# EAGLE design av3-batter-board (EAGLE 5.10)
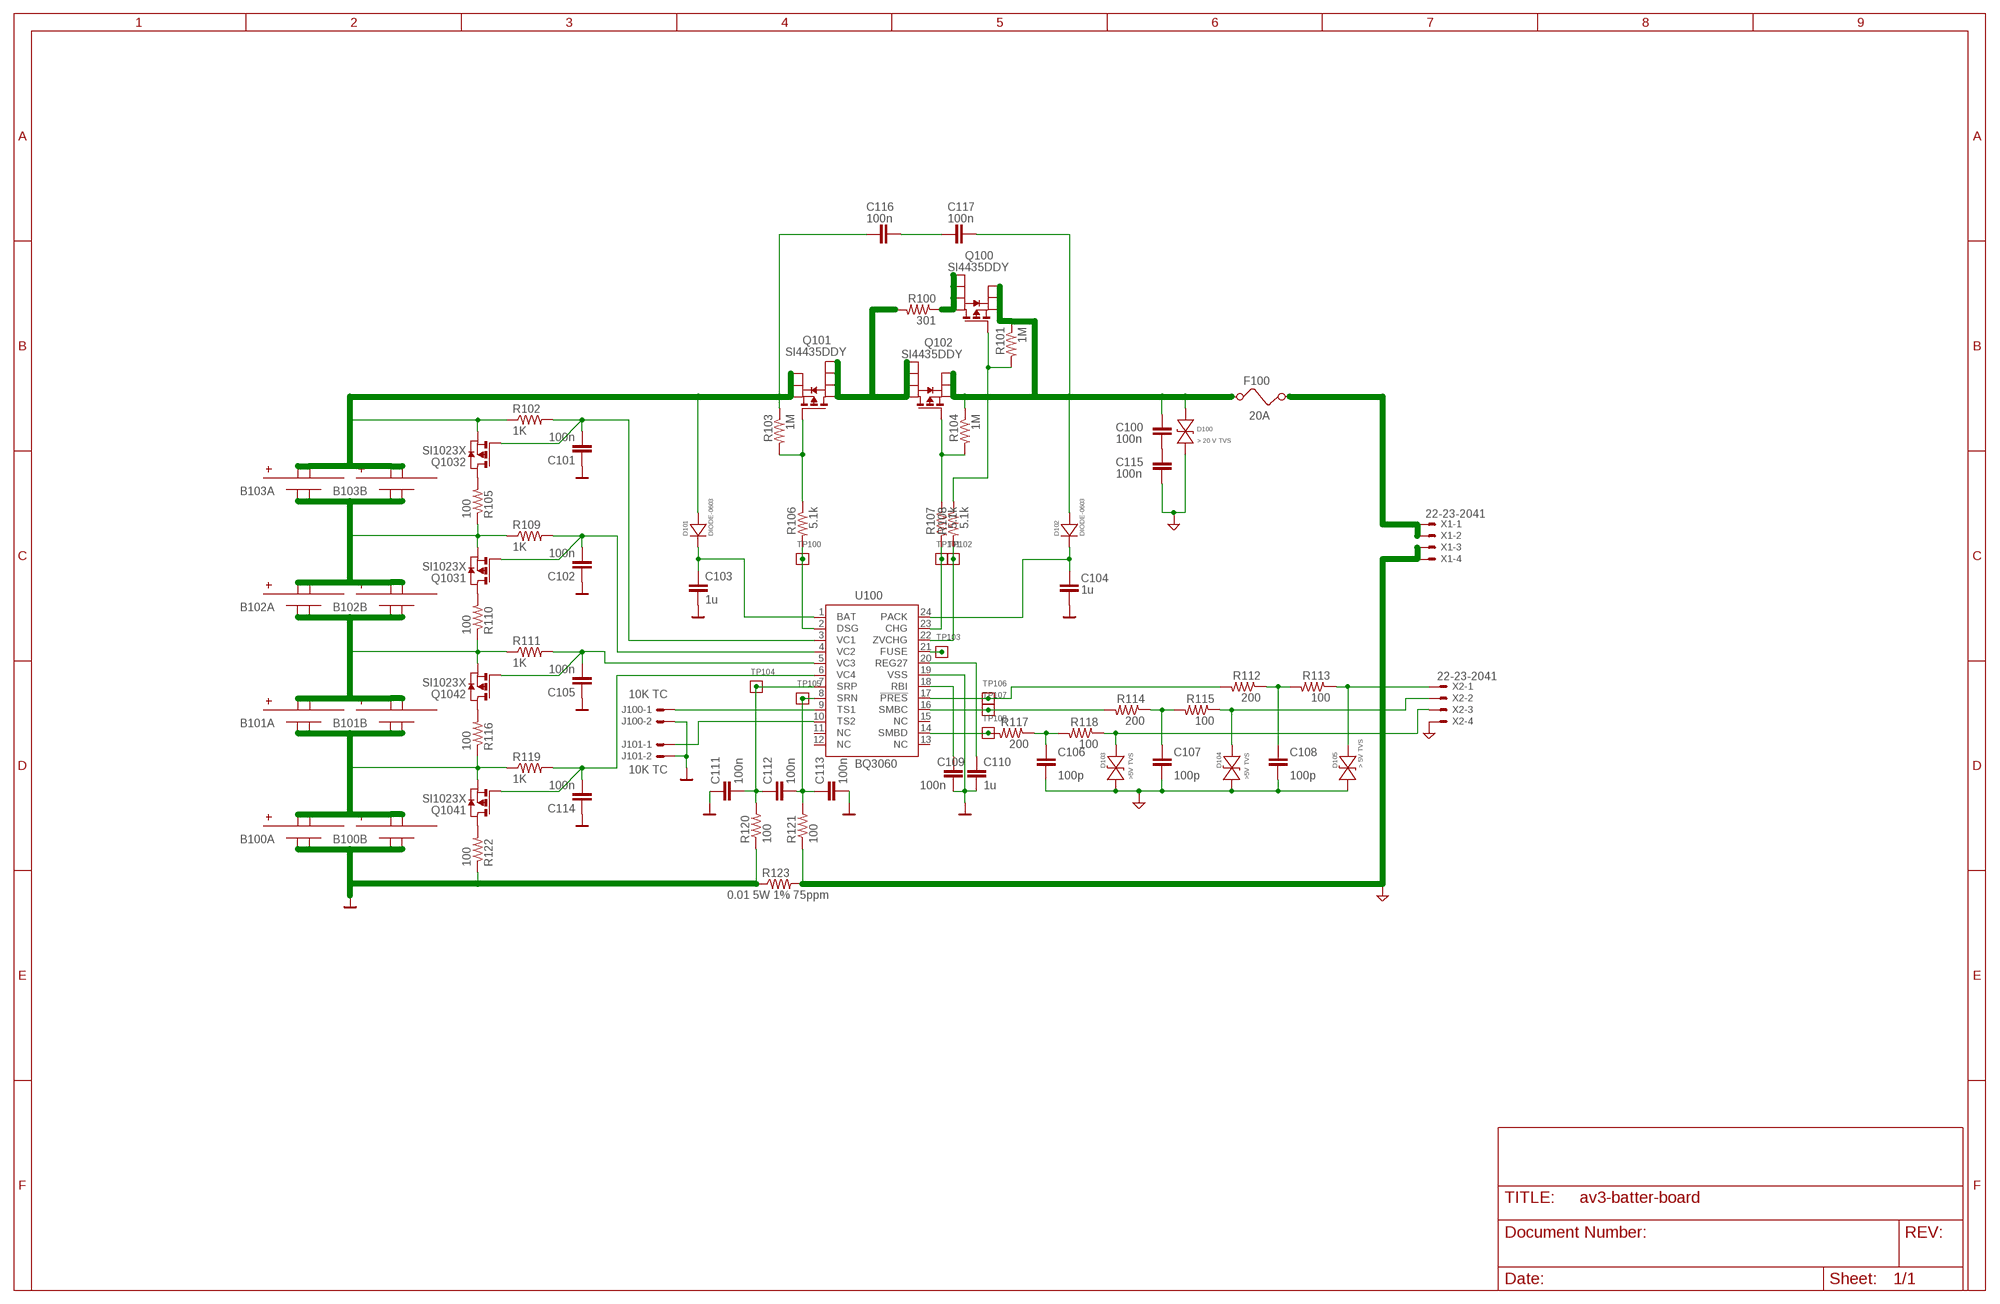
[diagram p0: schematic, sheet 1]

## Parts
B100A  LIPO-8AHR  [LIPO-8AHR-PAC]
B100B  LIPO-8AHR  [LIPO-8AHR-PAC]
B101A  LIPO-8AHR  [LIPO-8AHR-PAC]
B101B  LIPO-8AHR  [LIPO-8AHR-PAC]
B102A  LIPO-8AHR  [LIPO-8AHR-PAC]
B102B  LIPO-8AHR  [LIPO-8AHR-PAC]
B103A  LIPO-8AHR  [LIPO-8AHR-PAC]
B103B  LIPO-8AHR  [LIPO-8AHR-PAC]
C100  100n  C-EU0603-B-NOSILK  [0603-B-NOSILK]
C101  100n  C-EU0603-B-NOSILK  [0603-B-NOSILK]
C102  100n  C-EU0603-B-NOSILK  [0603-B-NOSILK]
C103  1u  C-EU0603-B-NOSILK  [0603-B-NOSILK]
C104  1u  C-EU0603-B-NOSILK  [0603-B-NOSILK]
C105  100n  C-EU0603-B-NOSILK  [0603-B-NOSILK]
C106  100p  C-EU0603-B-NOSILK  [0603-B-NOSILK]
C107  100p  C-EU0603-B-NOSILK  [0603-B-NOSILK]
C108  100p  C-EU0603-B-NOSILK  [0603-B-NOSILK]
C109  100n  C-EU0603-B-NOSILK  [0603-B-NOSILK]
C110  1u  C-EU0603-B-NOSILK  [0603-B-NOSILK]
C111  100n  C-EU0603-B-NOSILK  [0603-B-NOSILK]
C112  100n  C-EU0603-B-NOSILK  [0603-B-NOSILK]
C113  100n  C-EU0603-B-NOSILK  [0603-B-NOSILK]
C114  100n  C-EU0603-B-NOSILK  [0603-B-NOSILK]
C115  100n  C-EU0603-B-NOSILK  [0603-B-NOSILK]
C116  100n  C-EU0603-B-NOSILK  [0603-B-NOSILK]
C117  100n  C-EU0603-B-NOSILK  [0603-B-NOSILK]
D100  > 20 V TVS  TVS-0603  [0603-B-NOSILK-DIODE]
D101  DIODE-0603  [0603-B-NOSILK-DIODE]
D102  DIODE-0603  [0603-B-NOSILK-DIODE]
D103  >5V TVS  TVS-0603  [0603-B-NOSILK-DIODE]
D104  >5V TVS  TVS-0603  [0603-B-NOSILK-DIODE]
D105  > 5V TVS  TVS-0603  [0603-B-NOSILK-DIODE]
F100  20A  FUSE1206  [1206]
J100  87758-0216  [87758-0216]
J101  87758-0216  [87758-0216]
Q100  SI4435DDY  [SO-8]
Q101  SI4435DDY  [SO-8]
Q102  SI4435DDY  [SO-8]
Q103  SI1023X  [SOT-563]
Q104  SI1023X  [SOT-563]
R100  301  R-US_0603-B-NOSILK  [0603-B-NOSILK]
R101  1M  R-US_0603-B-NOSILK  [0603-B-NOSILK]
R102  1K  R-US_0603-B-NOSILK  [0603-B-NOSILK]
R103  1M  R-US_0603-B-NOSILK  [0603-B-NOSILK]
R104  1M  R-US_0603-B-NOSILK  [0603-B-NOSILK]
R105  100  R-US_0603-B-NOSILK  [0603-B-NOSILK]
R106  5.1k  R-US_0603-B-NOSILK  [0603-B-NOSILK]
R107  5.1k  R-US_0603-B-NOSILK  [0603-B-NOSILK]
R108  5.1k  R-US_0603-B-NOSILK  [0603-B-NOSILK]
R109  1K  R-US_0603-B-NOSILK  [0603-B-NOSILK]
R110  100  R-US_0603-B-NOSILK  [0603-B-NOSILK]
R111  1K  R-US_0603-B-NOSILK  [0603-B-NOSILK]
R112  200  R-US_0603-B-NOSILK  [0603-B-NOSILK]
R113  100  R-US_0603-B-NOSILK  [0603-B-NOSILK]
R114  200  R-US_0603-B-NOSILK  [0603-B-NOSILK]
R115  100  R-US_0603-B-NOSILK  [0603-B-NOSILK]
R116  100  R-US_0603-B-NOSILK  [0603-B-NOSILK]
R117  200  R-US_0603-B-NOSILK  [0603-B-NOSILK]
R118  100  R-US_0603-B-NOSILK  [0603-B-NOSILK]
R119  1K  R-US_0603-B-NOSILK  [0603-B-NOSILK]
R120  100  R-US_0603-B-NOSILK  [0603-B-NOSILK]
R121  100  R-US_0603-B-NOSILK  [0603-B-NOSILK]
R122  100  R-US_0603-B-NOSILK  [0603-B-NOSILK]
R123  0.01 5W 1% 75ppm  R-US-2818  [VISHAY-2818]
TP100  TEST-POINT  [2MM-TEST-POINT]
TP101  TEST-POINT  [2MM-TEST-POINT]
TP102  TEST-POINT  [2MM-TEST-POINT]
TP103  TEST-POINT  [2MM-TEST-POINT]
TP104  TEST-POINT  [2MM-TEST-POINT]
TP105  TEST-POINT  [2MM-TEST-POINT]
TP106  TEST-POINT  [2MM-TEST-POINT]
TP107  TEST-POINT  [2MM-TEST-POINT]
TP108  TEST-POINT  [2MM-TEST-POINT]
U100  BQ3060PW  [PW-R-PDSO-G24]
X1  22-23-2041  [22-23-2041]
X2  22-23-2041  [22-23-2041]

## Nets
B+: B103A.B+@1(B+) B103A.B+@2(B+) B103B.B+@1(B+) B103B.B+@2(B+) C116.1 D101.ANODE Q101.1(S) Q101.2(S) Q101.3(S) Q103.4(2:S) R102.1 R103.1
BAR_GND: B100A.B-@1(B-) B100A.B-@2(B-) B100B.B-@1(B-) B100B.B-@2(B-) C101.1 C102.1 C103.2 C104.2 C105.1 C109.2 C110.2 C111.1 C113.2 C114.1 J100.2 J101.2 R120.1 R122.1 R123.P$1 U100.19(VSS) ; supply symbol labelled SUP_GND_BAR
N$1: J100.1 U100.9(TS1)
N$2: J101.1 U100.10(TS2)
N$3: C103.1 D101.CATHODE U100.1(BAT)
N$4: B101A.B+@1(B+) B101A.B+@2(B+) B101B.B+@1(B+) B101B.B+@2(B+) B102A.B-@1(B-) B102A.B-@2(B-) B102B.B-@1(B-) B102B.B-@2(B-) Q104.4(2:S) R110.1 R111.1
N$5: C111.2 C112.1 R120.2 TP104.1 U100.7(SRP)
N$6: C112.2 C113.1 R121.2 TP105.1 U100.8(SRN)
N$7: B100A.B+@1(B+) B100A.B+@2(B+) B100B.B+@1(B+) B100B.B+@2(B+) B101A.B-@1(B-) B101A.B-@2(B-) B101B.B-@1(B-) B101B.B-@2(B-) Q104.1(1:S) R116.1 R119.1
N$8: B102A.B+@1(B+) B102A.B+@2(B+) B102B.B+@1(B+) B102B.B+@2(B+) B103A.B-@1(B-) B103A.B-@2(B-) B103B.B-@1(B-) B103B.B-@2(B-) Q103.1(1:S) R105.1 R109.1
N$9: Q104.3(2:D) R116.2
N$10: C102.2 Q103.2(1:G) R109.2 U100.4(VC2)
N$11: C105.2 Q104.5(2:G) R111.2 U100.5(VC3)
N$12: C114.2 Q104.2(1:G) R119.2 U100.6(VC4)
N$13: C109.1 U100.18(RBI)
N$14: C110.1 U100.20(REG27)
N$15: R117.2 TP108.1 U100.14(SMBD)
N$16: R114.2 TP107.1 U100.16(SMBC)
N$17: C106.1 R117.1 R118.2
N$18: Q104.6(1:D) R122.2
N$19: C101.2 Q103.5(2:G) R102.2 U100.3(VC1)
N$20: Q103.6(1:D) R110.2
N$21: Q103.3(2:D) R105.2
N$22: D103.ANODE R118.1 X2.3
N$23: R112.2 TP106.1 U100.17(!PRES)
N$24: C107.1 R114.1 R115.2
N$25: D104.ANODE R115.1 X2.2
N$26: F100.2 X1.1 X1.2
N$27: R106.2 TP100.1 U100.2(DSG)
N$28: Q101.5(D) Q101.6(D) Q101.7(D) Q101.8(D) Q102.5(D) Q102.6(D) Q102.7(D) Q102.8(D) R100.2
N$29: R108.2 TP102.1 U100.22(ZVCHG)
N$30: R107.2 TP101.1 U100.23(CHG)
N$31: C104.1 D102.CATHODE U100.24(PACK)
N$32: C100.1 C117.2 D100.ANODE D102.ANODE F100.1 Q100.1(S) Q100.2(S) Q100.3(S) Q102.1(S) Q102.2(S) Q102.3(S) R101.1 R104.1
N$33: C108.1 R112.1 R113.2
N$34: Q101.4(G) R103.2 R106.1
N$35: D105.ANODE R113.1 X2.1
N$36: Q102.4(G) R104.2 R107.1
N$37: C100.2 C115.1
N$38: TP103.1 U100.21(FUSE)
N$39: Q100.4(G) R101.2 R108.1
N$40: C116.2 C117.1
N$41: Q100.5(D) Q100.6(D) Q100.7(D) Q100.8(D) R100.1
TRIANGLE_GND: C106.2 C107.2 C108.2 C115.2 D100.CATHODE D103.CATHODE D104.CATHODE D105.CATHODE R121.1 R123.P$2 X1.3 X1.4 X2.4 ; supply symbol labelled SUP_GND_TRIANGLE
Unconnected: U100.11(NC) U100.12(NC) U100.13(NC) U100.15(NC)

## Notes on the sheet
- 10K TC
- 10K TC

## Library data of the parts
B100A B100B B101A B101B B102A B102B B103A B103B = battery:LIPO-8AHR
C100-C117 = rcl_custom:C-EU: CAPACITOR, European symbol
D100 D103-D105 = tvs-0603:TVS-0603
D101 D102 = diode-0603:DIODE-0603
F100 = psas:FUSE: Fuse
J100 J101 = con-molex:87758-0216: 2 Pin - 2mm Dual Row Single Wafer, Vertical T/H HDR Source: http://www.molex.com/pdm_docs/sd/877580616_sd.pdf
Q100-Q102 = si4435ddy:SI4435DDY
Q103 Q104 = si1023x:SI1023X
R100-R122 = rcl_custom:R-US_: RESISTOR, American symbol
R123 = shunt:R-US-2818
TP100-TP108 = Tova:TEST-POINT
U100 = bq3060:BQ3060
X1 X2 = con-molex:22-23-2041: .100" (2.54mm) Center Header - 4 Pin

## Board
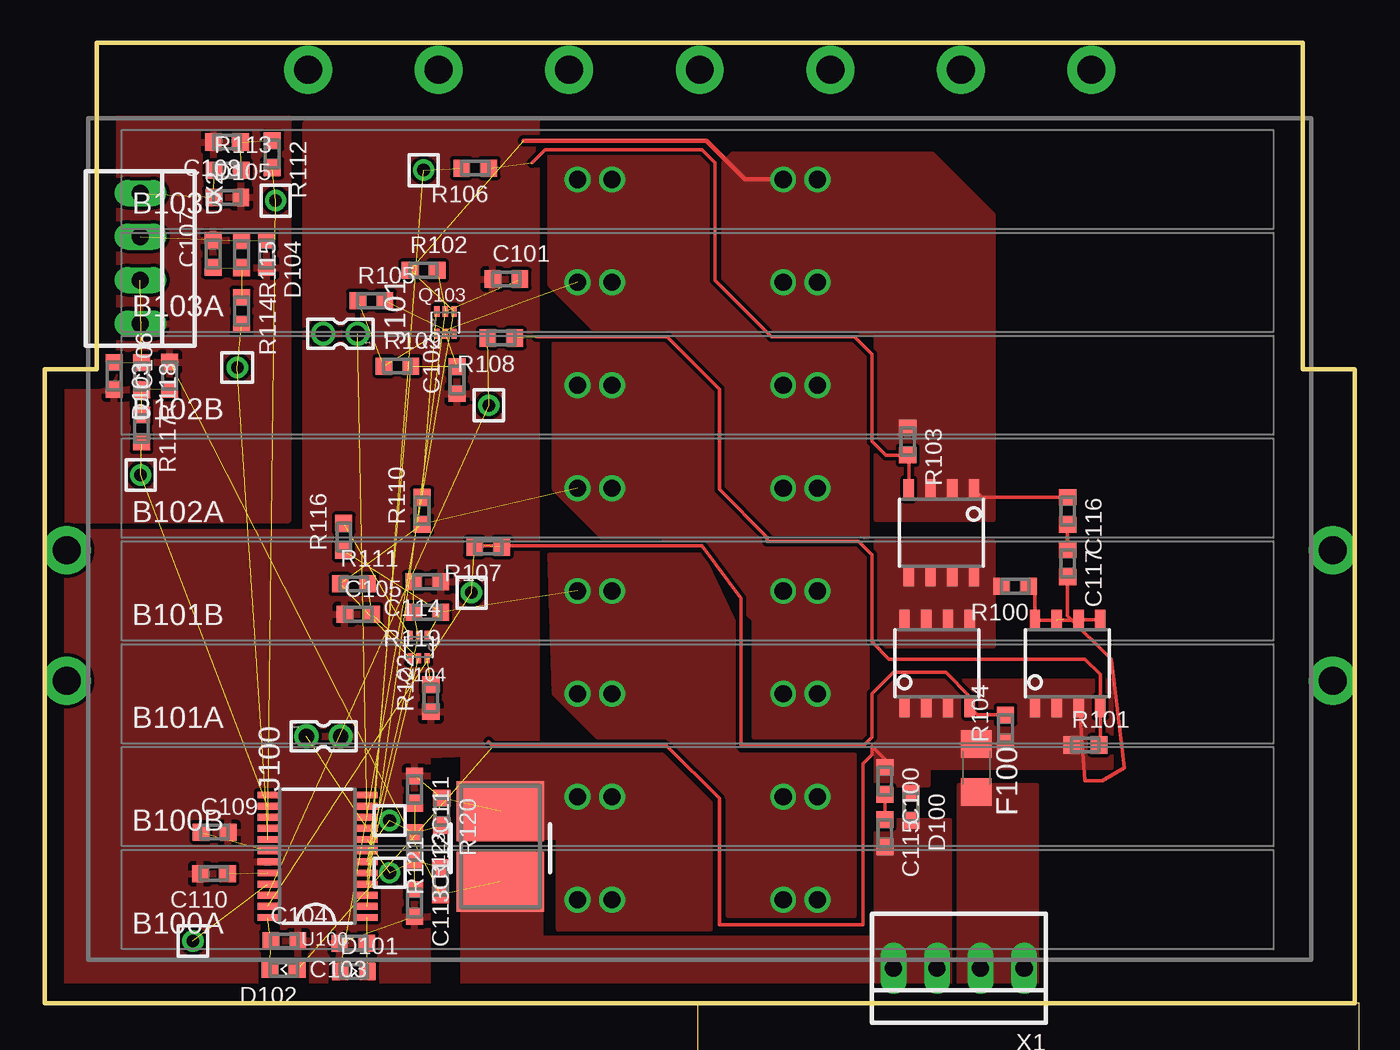
[diagram p1: board, top side]

Size 76.45 x 56.01 mm. Coordinates in mm from the lower left corner, seen from the top.
Outline: 0,36.96 3.05,36.96 3.05,56.01 73.41,56.01 73.41,36.96 76.45,36.96 76.45,0 0,0 0,36.96
Copper layers (1*16): Top 0.035mm / dielectric 1.5mm / Bottom 0.035mm
Design rules "default": minimum track width 10mil, minimum drill 24mil, track to track 8mil, track to pad 8mil, pad to pad 8mil, via to via 8mil, smd to smd 8mil, copper to edge 40mil, drill to drill 8mil, minimum pad ring 10mil, minimum via ring 8mil, stop-mask expansion 4mil, vias tented up to drill 0mil, thermal gap 10mil
Milling: area 38.1,-7.9 to 76.7,0

### Footprints (pad centres in the part's own frame; a part is rotated, then mirrored left to right if it is on the bottom)
LIPO-8AHR-PAC = drill 1 round: B+@1 5,0; B+@2 7,0; B-@1 -5,0; B-@2 -7,0
0603-B-NOSILK = smd 0.95 x 1: 1 -0.8,0; 2 0.8,0
0603-B-NOSILK-DIODE = smd 0.95 x 1: ANODE -0.8,0; CATHODE 0.8,0
1206 = smd 1.6 x 1.8: 1 -1.4,0; 2 1.4,0
87758-0216 = drill 0.9 pad 1.27 round: 1 0,-1; 2 0,1
SO-8 = smd 0.6 x 1.2: 1 -1.905,-2.527; 2 -0.635,-2.527; 3 0.635,-2.527; 4 1.905,-2.527; 5 1.905,2.527; 6 0.635,2.527; 7 -0.635,2.527; 8 -1.905,2.527
SOT-563 = smd 0.3 x 0.6: 1 -0.5,-0.65; 2 0,-0.65; 3 0.5,-0.65; 4 0.5,0.65; 5 0,0.65; 6 -0.5,0.65
VISHAY-2818 = smd 3.5 x 5.1: P$1 2.055,0; P$2 -2.055,0
2MM-TEST-POINT = drill 0.737 round: 1 0,0
PW-R-PDSO-G24 = smd 0.4 x 1.2: 1 -3.575,-2.9; 2 -2.925,-2.9; 3 -2.275,-2.9; 4 -1.625,-2.9; 5 -0.975,-2.9; 6 -0.325,-2.9; 7 0.325,-2.9; 8 0.975,-2.9; 9 1.625,-2.9; 10 2.275,-2.9; 11 2.925,-2.9; 12 3.575,-2.9; 13 3.575,2.9; 14 2.925,2.9; 15 2.275,2.9; 16 1.625,2.9; 17 0.975,2.9; 18 0.325,2.9; 19 -0.325,2.9; 20 -0.975,2.9; 21 -1.625,2.9; 22 -2.275,2.9; 23 -2.925,2.9; 24 -3.575,2.9
22-23-2041 = drill 1 long: 1 -3.81,0; 2 -1.27,0; 3 1.27,0; 4 3.81,0

### Placement (x,y rotation side)
B100A  38.1,6.04 0 top
B100B  38.1,12.04 0 top
B101A  38.1,18.04 0 top
B101B  38.1,24.04 0 top
B102A  38.1,30.04 0 top
B102B  38.1,36.04 0 top
B103A  38.1,42.04 0 top
B103B  38.1,48.04 0 top
C100  49.02,12.95 270 top
C101  26.94,42.23 0 top
C102  24.06,36.34 90 top
C103  18.02,3.49 180 top
C104  13.99,3.62 0 top
C105  18.3,22.67 0 top
C106  7.3,36.59 90 top
C107  9.84,43.7 90 top
C108  10.65,50.22 180 top
C109  9.92,9.97 0 top
C110  9.89,7.55 180 top
C111  21.59,12.45 270 top
C112  21.59,9.14 270 top
C113  21.59,5.84 270 top
C114  22.34,24.57 180 top
C115  49.02,9.91 270 top
C116  59.69,28.7 270 top
C117  59.69,25.65 270 top
D100  50.55,11.43 270 top
D101  18.05,1.85 0 top
D102  13.95,1.96 180 top
D103  4.06,36.58 270 top
D104  12.95,43.69 270 top
D105  10.67,46.99 0 top
F100  54.36,13.72 270 top
J100  16.27,15.56 270 top
J101  17.26,39.05 90 top
Q100  59.69,19.81 0 top
Q101  52.32,27.43 180 top
Q102  52.07,19.81 0 top
Q103  23.38,39.69 0 top
Q104  21.83,20.76 180 top
R100  56.63,24.32 180 top
R101  60.72,15.05 0 top
R102  22.11,42.74 0 top
R103  50.36,32.75 270 top
R104  56.07,16.02 90 top
R105  19.07,40.96 0 top
R106  25.13,48.7 180 top
R107  25.89,26.6 180 top
R108  26.65,38.79 180 top
R109  20.59,37.15 0 top
R110  22.03,28.72 90 top
R111  18.05,24.45 0 top
R112  13.28,49.51 270 top
R113  10.68,48.58 0 top
R114  11.5,40.37 270 top
R115  11.5,43.67 270 top
R116  17.46,27.19 90 top
R117  5.66,33.51 270 top
R118  5.66,36.56 270 top
R119  22.34,22.79 180 top
R120  23.18,11.16 270 top
R121  23.11,7.11 90 top
R122  22.54,17.8 90 top
R123  26.6,9.13 90 top
TP100  22.11,48.58 0 top
TP101  24.91,23.94 0 top
TP102  25.92,34.87 0 top
TP103  8.65,3.62 0 top
TP104  20.13,10.65 270 top
TP105  20.13,7.6 270 top
TP106  13.48,46.8 0 top
TP107  11.24,37.07 270 top
TP108  5.6,30.8 0 top
U100  15.93,8.56 90 top
X1  53.34,2.03 180 top
X2  5.59,43.43 270 top

### Tracks (layer width: path | path; a pad name or v marks a point on that pad's centre or on a via)
B+  (3 unrouted)
  Top 0.203: C116.1 54.69,29.5 Q101.1
  Top 0.254: B103B.B+@1 40.86,48.04 38.61,50.29 27.94,50.29
  pour Top (rank 3, no thermals): 39.62,49.02 39.62,42.16 42.67,39.12 48.51,39.12 48.51,28.19 55.37,28.19 55.37,45.97 51.82,49.53 40.13,49.53
BAR_GND  (3 unrouted)
  pour Top (rank 3, no thermals): 38.86,4.32 38.86,11.68 36.07,14.48 24.38,14.48 24.38,9.65 29.97,9.65 29.97,4.32
  pour Top: 28.7,14.73 28.7,51.56 16.26,51.31 15.24,51.31 15.24,27.43 -2.29,27.43 -2.29,26.42 -2.03,0.25 22.35,0.25 22.35,14.48
N$1  (1 unrouted)
N$2  (1 unrouted)
N$3  (2 unrouted)
N$4  (3 unrouted)
  pour Top (rank 3, no thermals): 48.01,15.49 48.01,26.67 42.16,26.67 39.12,29.72 39.12,35.81 36.32,38.61 29.72,38.61 29.72,29.97 32.51,27.18 36.07,27.18 41.4,22.35 41.4,15.49
N$5  (4 unrouted)
N$6  (4 unrouted)
N$7  (3 unrouted)
  pour Top (rank 3, no thermals): 47.24,5.08 47.24,14.48 40.39,14.48 40.39,21.84 38.35,26.16 29.46,26.16 29.72,18.03 32.26,15.49 36.32,15.49 39.88,11.94 39.88,5.08
N$8  (3 unrouted)
  pour Top (rank 3, no thermals): 48.01,27.18 48.01,38.61 42.42,38.61 39.12,41.91 39.12,48.77 38.35,49.53 29.46,49.53 29.46,41.91 32,39.37 36.32,39.37 39.62,36.07 39.62,29.97 42.42,27.18
N$9  (1 unrouted)
N$10  (3 unrouted)
N$11  (3 unrouted)
N$12  (3 unrouted)
N$13  (1 unrouted)
N$14  (1 unrouted)
N$15  (2 unrouted)
N$16  (2 unrouted)
N$17  (2 unrouted)
N$18  (1 unrouted)
N$19  (3 unrouted)
N$20  (1 unrouted)
N$21  (1 unrouted)
N$22  (2 unrouted)
N$23  (2 unrouted)
N$24  (2 unrouted)
N$25  (2 unrouted)
N$26
  pour Top (rank 3, no thermals): 57.91,12.7 53.34,12.7 53.34,0 57.91,0
N$27  (2 unrouted)
N$28
  pour Top (rank 3, no thermals): 48.51,26.92 55.37,26.92 55.37,20.83 48.51,20.83
N$29  (2 unrouted)
N$30  (2 unrouted)
N$31  (2 unrouted)
N$32  (1 unrouted)
  Top 0.203: C100.1 49.02,14.22 48.26,14.99 48.26,14.48 47.75,13.97 47.75,4.57 39.37,4.57 39.37,11.94 36.32,14.99 26.16,14.99 25.91,15.24 | C117.2 59.69,22.61 62.23,20.07 62.99,13.72 61.72,12.95 60.71,12.95 60.45,16.26 60.45,17.16 Q100.3
  pour Top (rank 3, no thermals): 48.51,18.8 62.23,18.8 62.23,13.72 51.56,13.72 51.56,12.7 48.51,12.7
N$33  (2 unrouted)
N$34  (1 unrouted)
  Top 0.203: 28.45,49.02 29.21,49.78 38.35,49.78 39.12,49.02 39.12,42.16 42.42,38.86 47.24,38.86 48.26,37.85 48.26,32.77 49.08,31.95 R103.2 50.42,31.89 Q101.4
N$35  (2 unrouted)
N$36  (1 unrouted)
  Top 0.203: 25.65,26.67 38.35,26.67 40.64,23.62 40.64,14.99 47.75,14.99 48.26,15.49 48.26,18.03 49.53,19.3 52.58,19.3 53.98,17.91 Q102.4 54.44,16.82 R104.2
N$37
  Top 0.203: C115.1 C100.2
N$38  (1 unrouted)
N$39  (1 unrouted)
  Top 0.203: 28.7,38.86 36.32,38.86 39.37,35.81 39.37,29.97 42.16,27.18 42.16,26.92 47.5,26.92 48.26,26.16 48.26,21.08 49.28,20.07 60.71,20.07 61.59,19.18 Q100.4 61.59,15.13 R101.2
N$40
  Top 0.203: 59.69,27.94 C116.2 C117.1
N$41  (1 unrouted)
  Top 0.203: R100.1 57.61,24.13 57.66,24.13 57.78,24 Q100.8 59.42,22.34 59.44,22.35 59.45,22.34 Q100.6 60.34,22.35 61.72,22.35 61.71,22.34 Q100.5
N$47  (via drill 1.63 pad 2.79)
  other vias: 38.23,54.43
N$48  (via drill 1.63 pad 2.79)
  other vias: 1.3,26.42
N$49  (via drill 1.63 pad 2.79)
  other vias: 30.61,54.43
N$50  (via drill 1.63 pad 2.79)
  other vias: 1.3,18.8
N$51  (via drill 1.63 pad 2.79)
  other vias: 22.99,54.43
N$52  (via drill 1.63 pad 2.79)
  other vias: 15.37,54.43
N$53  (via drill 1.63 pad 2.79)
  other vias: 75.16,26.42
N$54  (via drill 1.63 pad 2.79)
  other vias: 75.16,18.8
N$55  (via drill 1.63 pad 2.79)
  other vias: 45.85,54.43
N$56  (via drill 1.63 pad 2.79)
  other vias: 53.47,54.43
N$57  (via drill 1.63 pad 2.79)
  other vias: 61.09,54.43
TRIANGLE_GND  (2 unrouted)
  pour Top (rank 3, no thermals): 52.83,0 52.83,10.67 48.51,10.67 48.51,3.81 28.96,3.81 28.96,8.64 24.38,8.64 24.38,0.25
  pour Top: 14.22,28.19 14.22,51.56 0.76,51.56 0.76,28.19